# Altium schematic sheet LEDs.SchDoc: Hardware Monitoring
size A3; Date: DO NOT USE, RATHER USE PROJ OPTIONS; DrawnBy: DO NOT USE, RATHER USE PROJ OPTIONS; Engineer: DO NOT USE, RATHER USE PROJ OPTIONS; Organization: DO NOT USE, RATHER USE PROJ OPTIONS; DocumentNumber: DO NOT USE, RATHER USE PROJ OPTIONS; Revision: DO NOT USE, RATHER USE PROJ OPTIONS; SheetNumber: 29; SheetTotal: 29; SCH_Sheet_Filename: LEDs.SchDoc; CurrentTime: DO NOT USE, RATHER USE PROJ OPTIONS; Time: DO NOT USE, RATHER USE PROJ OPTIONS; DocumentFullPathAndName: DO NOT USE, RATHER USE PROJ OPTIONS; DocumentName: DO NOT USE, RATHER USE PROJ OPTIONS; ModifiedDate: DO NOT USE, RATHER USE PROJ OPTIONS; ImagePath: DO NOT USE, RATHER USE PROJ OPTIONS
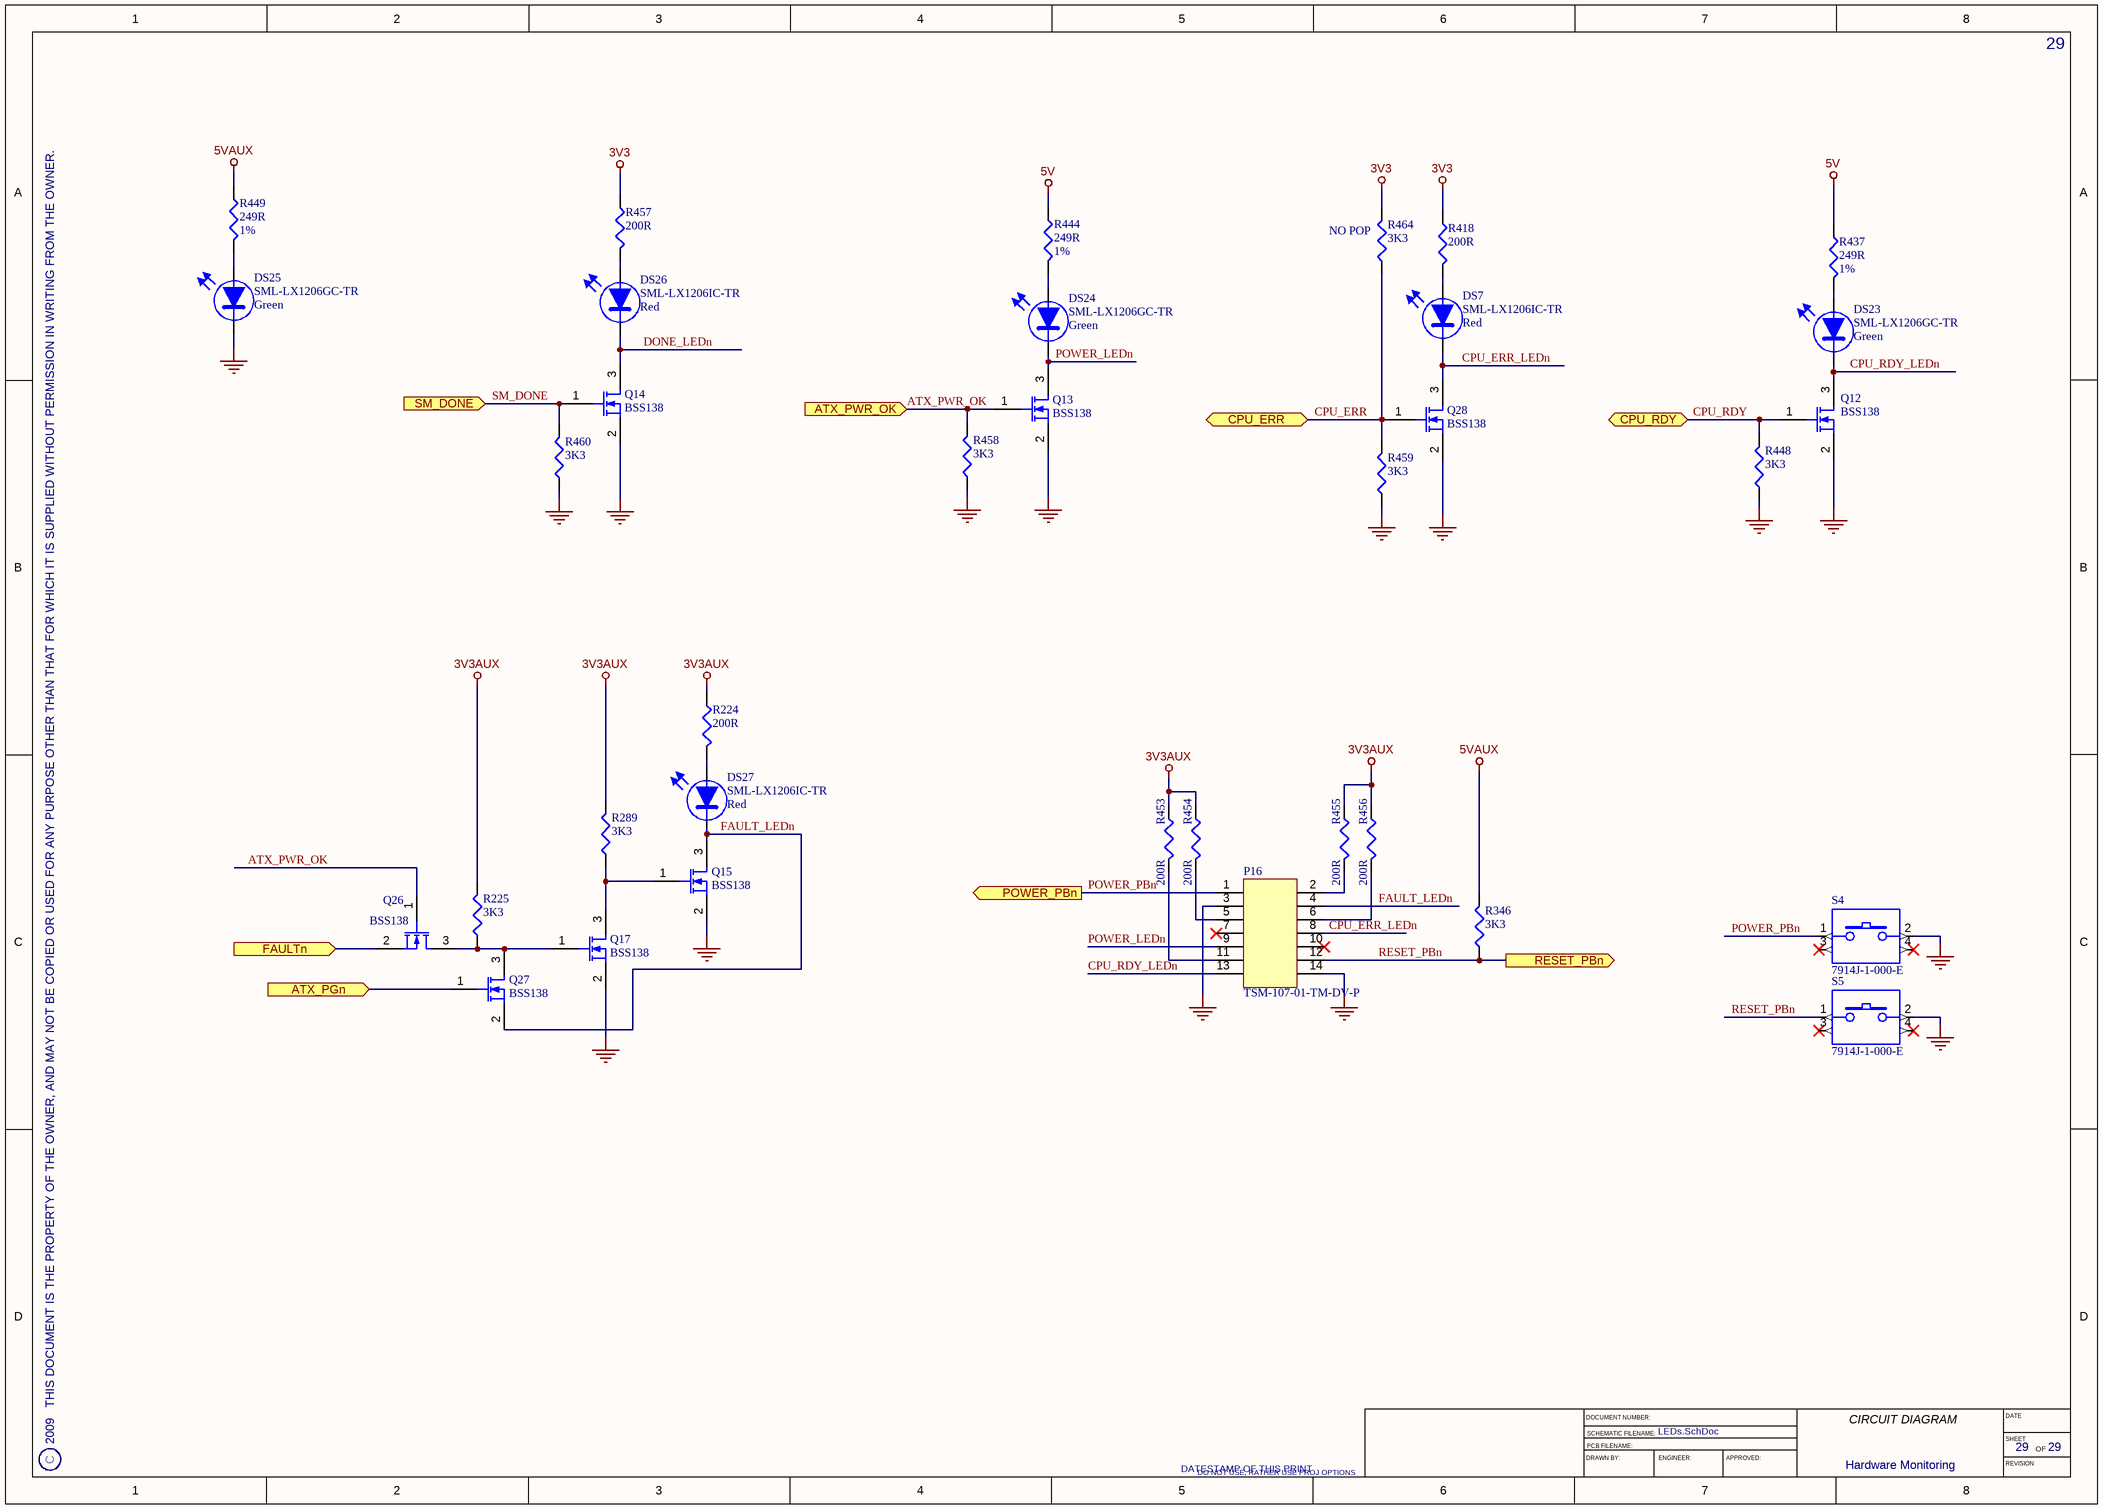
[diagram p0: LEDs.SchDoc]

## Parts
DS7  SML-LX1206IC-TR  Colour: Red  [LEDC3216X120N]
DS23  SML-LX1206GC-TR  Colour: Green  [LEDC3216X120N]
DS24  SML-LX1206GC-TR  Colour: Green  [LEDC3216X120N]
DS25  SML-LX1206GC-TR  Colour: Green  [LEDC3216X120N]
DS26  SML-LX1206IC-TR  Colour: Red  [LEDC3216X120N]
DS27  SML-LX1206IC-TR  Colour: Red  [LEDC3216X120N]
P16  TSM-107-01-TM-DV-P  [SAMTEC_TSM-107-01-TM-DV-P]
Q12  BSS138  [SOT95P245X110-3N]
Q13  BSS138  [SOT95P245X110-3N]
Q14  BSS138  [SOT95P245X110-3N]
Q15  BSS138  [SOT95P245X110-3N]
Q17  BSS138  [SOT95P245X110-3N]
Q26  BSS138  [SOT95P245X110-3N]
Q27  BSS138  [SOT95P245X110-3N]
Q28  BSS138  [SOT95P245X110-3N]
R224  200R  [RESC1005X40L]
R225  3K3  [RESC1005X40L]
R289  3K3  [RESC1005X40L]
R346  3K3  [RESC1005X40L]
R418  200R  [RESC1005X40L]
R437  Tolerance: 1%  [RESC1005X40L]  (hidden comment: 249R)
R444  Tolerance: 1%  [RESC1005X40L]  (hidden comment: 249R)
R448  3K3  [RESC1005X40L]
R449  Tolerance: 1%  [RESC1005X40L]  (hidden comment: 249R)
R453  200R  [RESC1005X40L]
R454  200R  [RESC1005X40L]
R455  200R  [RESC1005X40L]
R456  200R  [RESC1005X40L]
R457  200R  [RESC1005X40L]
R458  3K3  [RESC1005X40L]
R459  3K3  [RESC1005X40L]
R460  3K3  [RESC1005X40L]
R464  3K3  [RESC1005X40L]
S4  7914J-1-000-E  [7914J-X-XXX-X]
S5  7914J-1-000-E  [7914J-X-XXX-X]

## Ports
ATX_PGn (in), ATX_PWR_OK (in), CPU_ERR (bidir), CPU_RDY (bidir), FAULTn (in), POWER_PBn (out), RESET_PBn (out), SM_DONE (in)

## Nets
3V3: R418.1 R457.1 R464.2
3V3AUX: R224.1 R225.2 R289.2 R453.1 R454.1 R455.1 R456.1
5V: R437.1 R444.1
5VAUX: R346.2 R449.1
GND: DS25.1(K) P16.3 P16.14 Q12.2(S) Q13.2(S) Q14.2(S) Q15.2(S) Q17.2(S) Q28.2(S) R448.1 R458.1 R459.1 R460.1 S4.2 S5.2
ATX_PGn: Q27.1(G) ; port ATX_PGn
ATX_PWR_OK: Q13.1(G) Q26.1(G) R458.2 ; port ATX_PWR_OK
CPU_ERR: Q28.1(G) R459.2 R464.1 ; port CPU_ERR
CPU_ERR_LEDn: DS7.1(K) P16.8 Q28.3(D)
CPU_RDY: Q12.1(G) R448.2 ; port CPU_RDY
CPU_RDY_LEDn: DS23.1(K) P16.13 Q12.3(D)
DONE_LEDn: DS26.1(K) Q14.3(D)
FAULT_LEDn: DS27.1(K) P16.4 Q15.3(D) Q27.2(S)
FAULTn: Q26.2(S) ; port FAULTn
POWER_LEDn: DS24.1(K) P16.9 Q13.3(D)
POWER_PBn: P16.1 S4.1 ; port POWER_PBn
RESET_PBn: P16.12 R346.1 S5.1 ; port RESET_PBn
SM_DONE: Q14.1(G) R460.2 ; port SM_DONE
NetDS7_2: DS7.2(A) R418.2
NetDS23_2: DS23.2(A) R437.2
NetDS24_2: DS24.2(A) R444.2
NetDS25_2: DS25.2(A) R449.2
NetDS26_2: DS26.2(A) R457.2
NetDS27_2: DS27.2(A) R224.2
NetP16_2: P16.2 R455.2
NetP16_5: P16.5 R454.2
NetP16_6: P16.6 R456.2
NetP16_11: P16.11 R453.2
NetQ15_1: Q15.1(G) Q17.3(D) R289.1
NetQ17_1: Q17.1(G) Q26.3(D) Q27.3(D) R225.1

Not connected (* = marked no-connect by the designer): P16 7* 10*; S4 3* 4*; S5 3* 4*

## Notes on the sheet
- (near R464) NO POP
- 2009   THIS DOCUMENT IS THE PROPERTY OF THE OWNER, AND MAY NOT BE COPIED OR USED FOR ANY PURPOSE OTHER THAN THAT FOR WHICH IT IS SUPPLIED WITHOUT PERMISSION IN WRITING FROM THE OWNER.
- C
- DATESTAMP OF THIS PRINT
- DRAWN BY:
- DOCUMENT NUMBER:
- SCHEMATIC FILENAME:
- PCB FILENAME:
- ENGINEER:
- APPROVED:
- CIRCUIT DIAGRAM
- DATE
- SHEET
- REVISION
- OF

## Library data of the parts
DS7 DS26 DS27 = OPTO-LED-1: Red, Surface mount, LED, 1206; Manufacturer: LUMEX; Vdrop: 2V; Rating: 20mA; POD number: OPTO-LED-1; PartNum: SML-LX1206IC-TR; RoHS: Y; Category: OPTO; Subcategory: LED
DS23-DS25 = OPTO-LED-0: Green, Surface mount, LED, 1206; Manufacturer: LUMEX; Vdrop: 2.2V; Rating: 20mA; POD number: OPTO-LED-0; PartNum: SML-LX1206GC-TR; RoHS: Y; Category: OPTO; Subcategory: LED
P16 = CONN-PCB-16: 2x7, 2.54 mm Pitch, Male Header; Manufacturer: SAMTEC; POD number: CONN-PCB-16; PartNum: TSM-107-01-TM-DV-P; RoHS: Y; Category: CONN; Subcategory: PCB
Q12-Q15 Q17 Q26-Q28 = TRANS-NFET-0: N-Channel Logic Level Enhancement Mode Field Effect Transistor; Manufacturer: Fairchild Semiconductor; Rating: 0.22A; POD number: TRANS-NFET-0; PartNum: BSS138; RoHS: Y; Category: TRANS; Subcategory: NFET
R224 R418 R453-R457 = RES-TF-19: 200R, 1.1mm x 0.5mm, Thick Film Resistor; Manufacturer: ROYALOHM; PartNum: 0402WGF0201T1E; Tolerance: 1%; Rating: 0.0625W; POD number: RES-TF-19; Value: 200R; Sort Value: 200; Category: Resistors; Subcategory: ThickFilm; HelpURL: *.pdf
R225 R289 R346 R448 R458-R460 R464 = RES-TF-7: 3K3, 1.1mm x 0.5mm, Thick Film Resistor; Manufacturer: ROYALOHM; PartNum: 0402WGJ0332T1E; Tolerance: 5%; Rating: 0.0625W; POD number: RES-TF-7; Value: 3K3; Sort Value: 3300; Category: Resistors; Subcategory: ThickFilm; HelpURL: *.pdf
R437 R444 R449 = RES-TF-15: 249R, 1.1mm x 0.5mm, Thick Film Resistor; Manufacturer: ROYALOHM; PartNum: 0402WGF2490T1E; Rating: 0.0625W; POD number: RES-TF-15; Value: 249R; Sort Value: 249; Category: Resistors; Subcategory: ThickFilm; HelpURL: *.pdf
S4 S5 = ELMECH-SW-1: 4mm, Surface mount, Sealed Key Switch; Manufacturer: BOURNS; POD number: ELMECH-SW-1; PartNum: 7914J-1-000-E; RoHS: Y; Category: ELMECH; Subcategory: Switches